# Altium schematic sheet Alim sch projet robot.SchDoc
size A4; PageSetup: Record=PageOptions|CenterHorizontal=True|CenterVertical=True|PrintScale=1.42|XCorrection=1.00|YCorrection=1.00|PrintKind=0|BorderSize=5000000|LeftOffset=0|BottomOffset=0|Orientation=2|PaperLength=1000|PaperWidth=1000|Scale=100|PaperSource=7|PrintQuality=-4|MediaType=1|DitherType=10|PaperKind=A3|PrintScaleMode=1
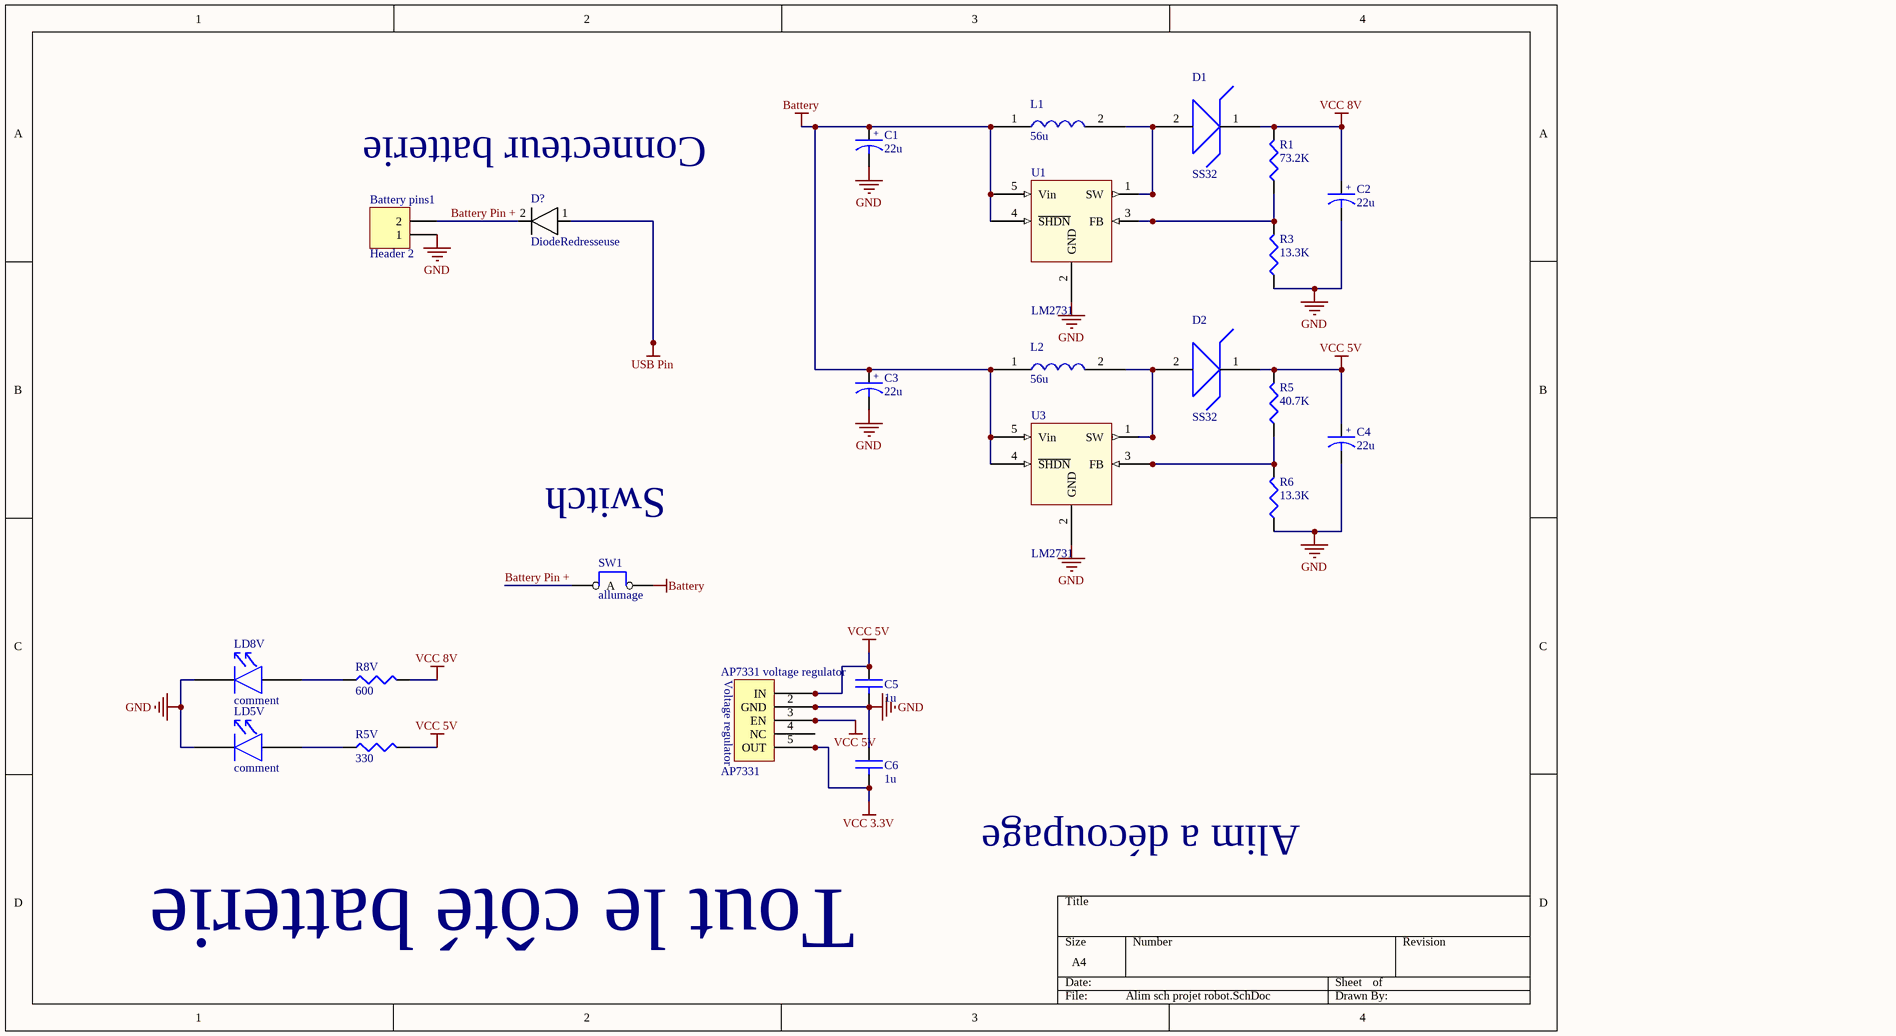
[diagram p0: Alim sch projet robot.SchDoc]

## Parts
AP7331_voltage_regulator  AP7331  [AP7331]
Battery_pins1  Header 2  [HDR1X2]
C1  value 22u  [293D/B]  (hidden comment: CAP_POL)
C2  value 22u  [293D/B]  (hidden comment: CAP_POL)
C3  value 22u  [293D/B]  (hidden comment: CAP_POL)
C4  value 22u  [293D/B]  (hidden comment: CAP_POL)
C5  value 1u  [0805]  (hidden comment: CAP)
C6  value 1u  [0805]  (hidden comment: CAP)
D1  SS32  [Schottly Diode SS32 footprint]
D2  SS32  [Schottly Diode SS32 footprint]
D?  DiodeRedresseuse  [Diode MULTICOMP SS16]
L1  value 56u  [1050]  (hidden comment: IND)
L2  value 56u  [1050]  (hidden comment: IND)
LD5V  comment  [LED1206]
LD8V  comment  [LED1206]
R1  value 73.2K  [0805]  (hidden comment: RES)
R3  value 13.3K  [0805]  (hidden comment: RES)
R5  value 40.7K  [0805]  (hidden comment: RES)
R5V  value 330  [0805]  (hidden comment: RES)
R6  value 13.3K  [0805]  (hidden comment: RES)
R8V  value 600  [0805]  (hidden comment: RES)
SW1  allumage  [JMP2-100]
U1  LM2731  [LM2731 footprint]
U3  LM2731  [LM2731 footprint]

## Nets
Battery: C1.1 C3.1 L1.1 L2.1 SW1.2(com) U1.4(~{SHDN}) U1.5(Vin) U3.4(~{SHDN}) U3.5(Vin)
GND: AP7331_voltage_regulator.2(GND) Battery_pins1.1 C1.2 C2.2 C3.2 C4.2 C5.2 C6.1 LD5V.K LD8V.K R3.1 R6.1 U1.2(GND) U3.2(GND)
USB Pin: D?.1
VCC 3.3V: AP7331_voltage_regulator.5(OUT) C6.2
VCC 5V: AP7331_voltage_regulator.1(IN) AP7331_voltage_regulator.3(EN) C4.1 C5.1 D2.1(Cathode_(+)) R5.2 R5V.2
VCC 8V: C2.1 D1.1(Cathode_(+)) R1.2 R8V.2
Battery Pin +: Battery_pins1.2 D?.2 SW1.1(A)
NetD1_2: D1.2(Anode_(-)) L1.2 U1.1(SW)
NetD2_2: D2.2(Anode_(-)) L2.2 U3.1(SW)
NetLD5V_A: LD5V.A R5V.1
NetLD8V_A: LD8V.A R8V.1
NetR1_1: R1.1 R3.2 U1.3(FB)
NetR5_1: R5.1 R6.2 U3.3(FB)

Not connected (* = marked no-connect by the designer): AP7331_voltage_regulator 4(NC)

## Notes on the sheet
- Connecteur batterie
- Switch
- Alim a découpage
- Tout le côté batterie
- (in symbol AP7331) Voltage regulator
- (in symbol CAP_POL) +

## Library data of the parts
Battery_pins1 = Header 2: Header, 2-Pin; LatestRevisionDate: 17-Jul-2002; LatestRevisionNote: Re-released for DXP Platform.; Publisher: Altium Limited
C1-C4 = CAP_POL: capacité polarisée
C5 C6 = CAP: capacité non polarisée
D1 D2 = SS32: Schottky Diode 20V 3A
L1 L2 = Shielded inductor: Shielded Inductor 1050
LD5V LD8V = LED: LED 5mm/3mm/CMS
R1 R3 R5 R5V R6 R8V = RES: resistance
SW1 = JUMPER2: cavalier 1 position
U1 U3 = LM2731: Boost switch regulator DCDC